# Altium schematic sheet ESC_C.SchDoc
size A3; SheetNumber: 9; SheetTotal: 10
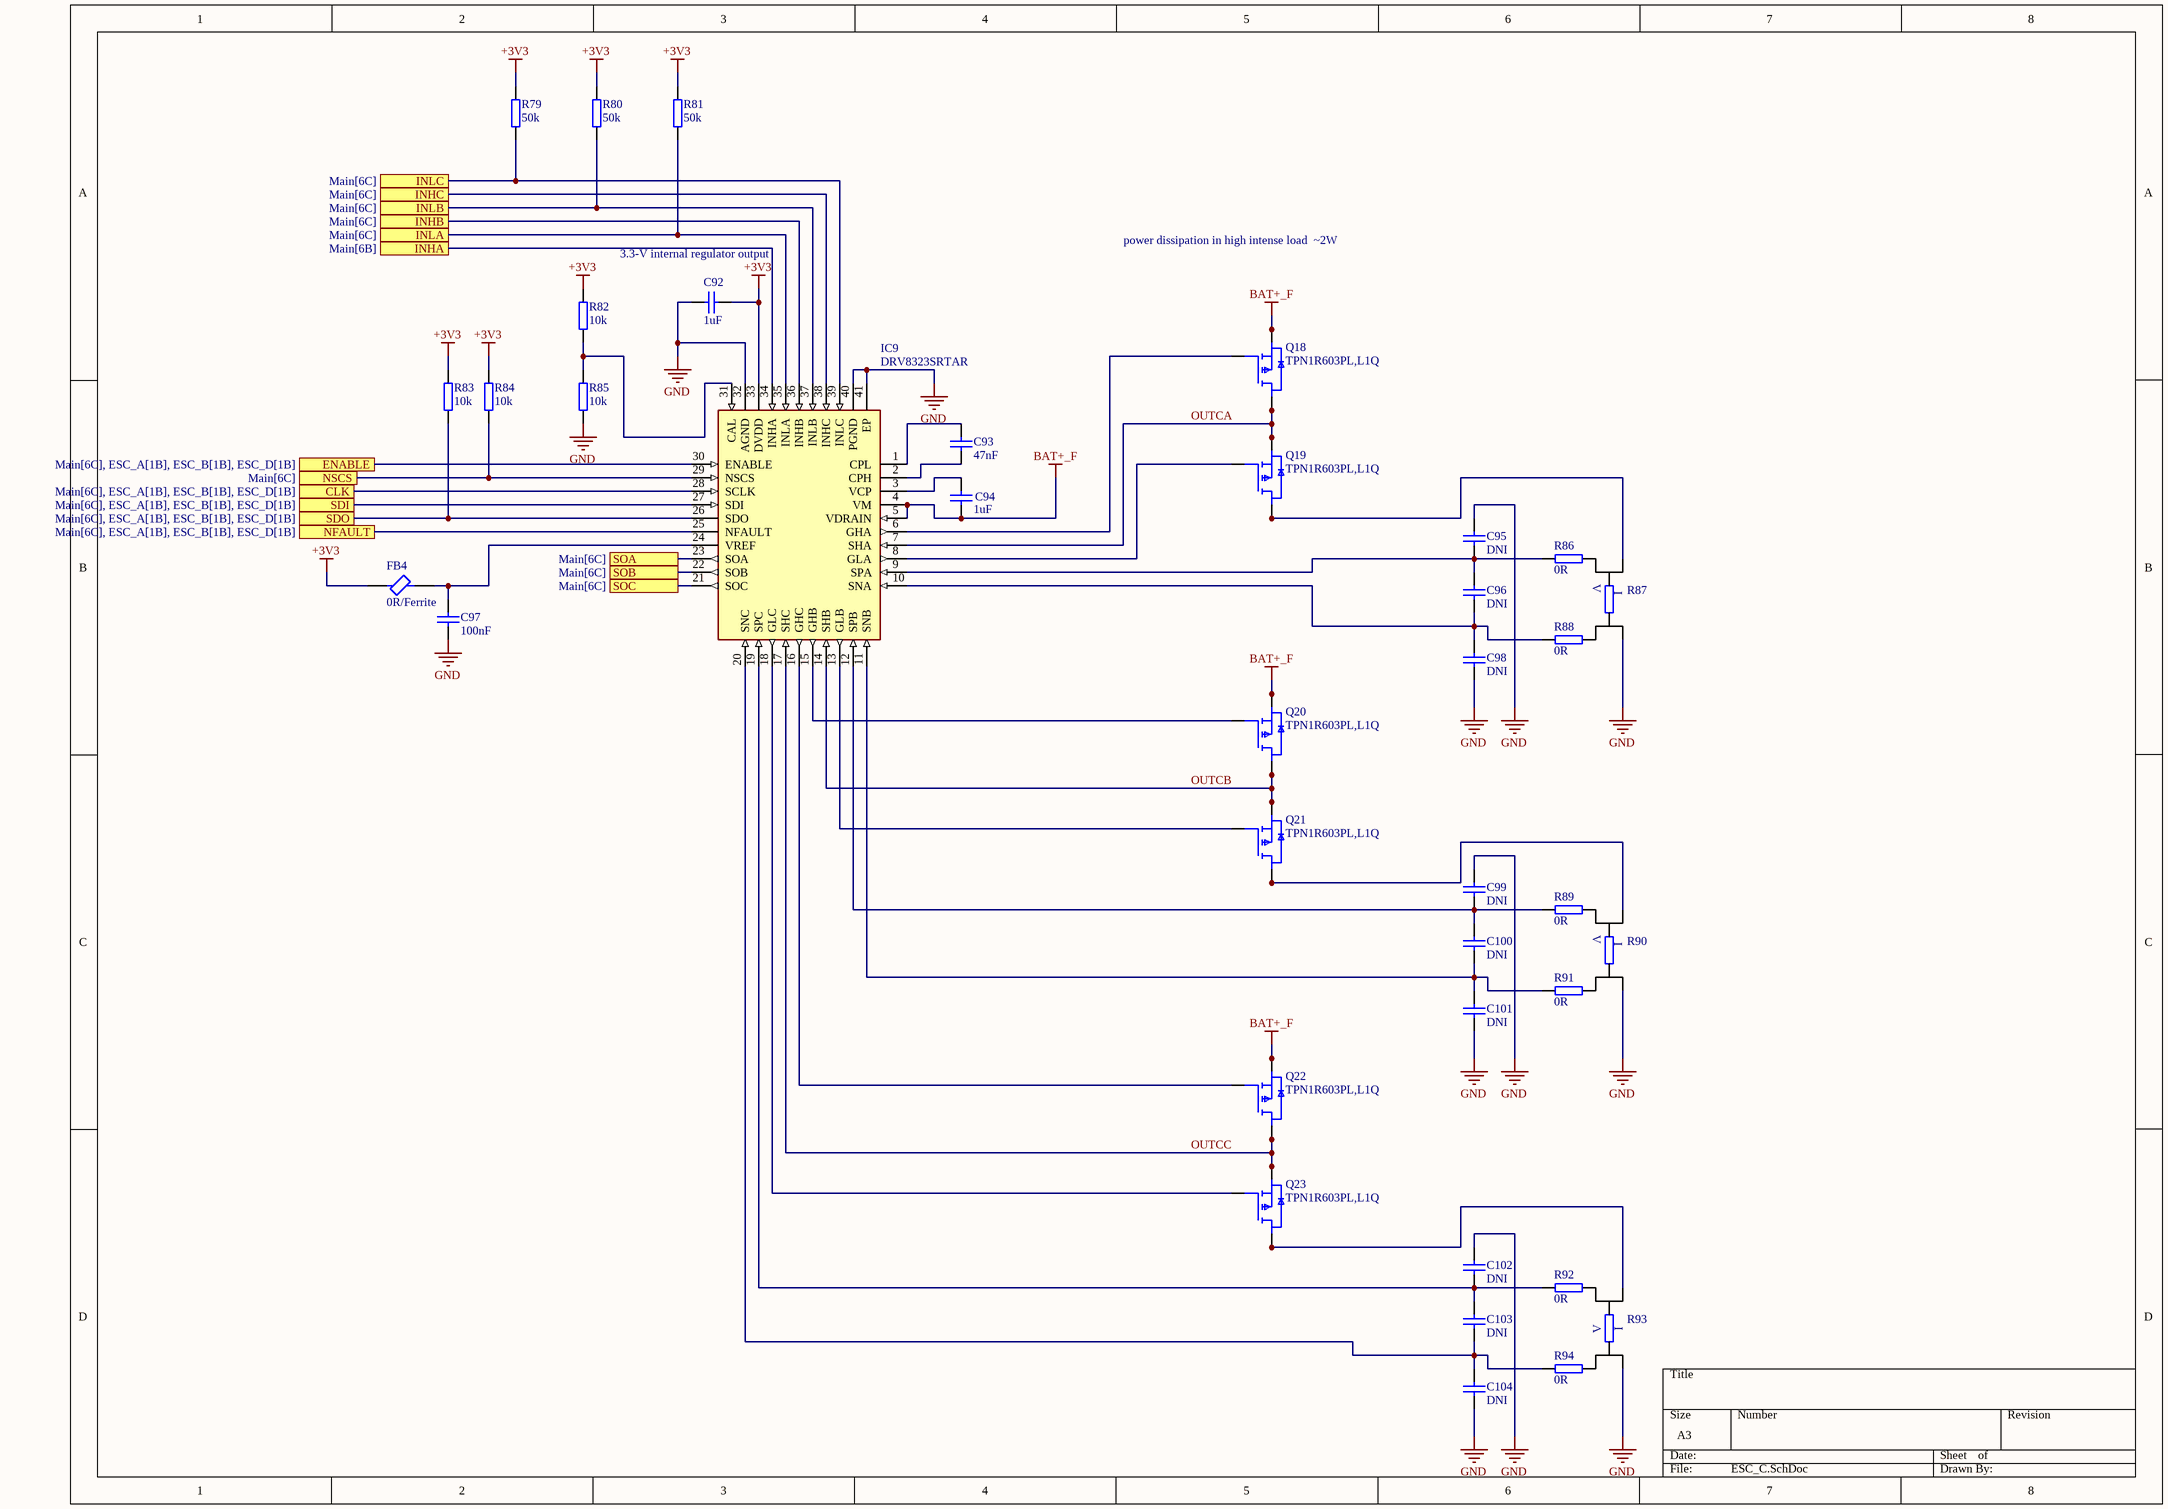
[diagram p0: ESC_C.SchDoc]

## Parts
C92  value 1uF  [CAP0402]  (hidden comment: Cap0402)
C93  value 47nF  [CAP0603]  (hidden comment: Cap0603)
C94  value 1uF  [CAP0603]  (hidden comment: Cap0603)
C95  value DNI  [CAP0402]  (hidden comment: Cap0402)
C96  value DNI  [CAP0402]  (hidden comment: Cap0402)
C97  value 100nF  [CAP0402]  (hidden comment: Cap0402)
C98  value DNI  [CAP0402]  (hidden comment: Cap0402)
C99  value DNI  [CAP0402]  (hidden comment: Cap0402)
C100  value DNI  [CAP0402]  (hidden comment: Cap0402)
C101  value DNI  [CAP0402]  (hidden comment: Cap0402)
C102  value DNI  [CAP0402]  (hidden comment: Cap0402)
C103  value DNI  [CAP0402]  (hidden comment: Cap0402)
C104  value DNI  [CAP0402]  (hidden comment: Cap0402)
FB4  0R/Ferrite  [NFZ15SG152SN10B]
IC9  DRV8323SRTAR  [QFN50P600X600X80-41N-D]
Q18  TPN1R603PL,L1Q  [TPN1R603PLL1Q]
Q19  TPN1R603PL,L1Q  [TPN1R603PLL1Q]
Q20  TPN1R603PL,L1Q  [TPN1R603PLL1Q]
Q21  TPN1R603PL,L1Q  [TPN1R603PLL1Q]
Q22  TPN1R603PL,L1Q  [TPN1R603PLL1Q]
Q23  TPN1R603PL,L1Q  [TPN1R603PLL1Q]
R79  value 50k  [RES0402]  (hidden comment: Res0402)
R80  value 50k  [RES0402]  (hidden comment: Res0402)
R81  value 50k  [RES0402]  (hidden comment: Res0402)
R82  value 10k  [RES0402]  (hidden comment: Res0402)
R83  value 10k  [RES0402]  (hidden comment: Res0402)
R84  value 10k  [RES0402]  (hidden comment: Res0402)
R85  value 10k  [RES0402]  (hidden comment: Res0402)
R86  value 0R  [RES0402]  (hidden comment: Res0402)
R87  WSK12161L000FEA  [WSK12161L000FEA]  (value not drawn)
R88  value 0R  [RES0402]  (hidden comment: Res0402)
R89  value 0R  [RES0402]  (hidden comment: Res0402)
R90  WSK12161L000FEA  [WSK12161L000FEA]  (value not drawn)
R91  value 0R  [RES0402]  (hidden comment: Res0402)
R92  value 0R  [RES0402]  (hidden comment: Res0402)
R93  WSK12161L000FEA  [WSK12161L000FEA]  (value not drawn)
R94  value 0R  [RES0402]  (hidden comment: Res0402)

## Ports
CLK (see Main[6C], ESC_A[1B], ESC_B[1B], ESC_D[1B]), ENABLE (see Main[6C], ESC_A[1B], ESC_B[1B], ESC_D[1B]), INHA (see Main[6B]), INHB (see Main[6C]), INHC (see Main[6C]), INLA (see Main[6C]), INLB (see Main[6C]), INLC (see Main[6C]), NFAULT (see Main[6C], ESC_A[1B], ESC_B[1B], ESC_D[1B]), NSCS (see Main[6C]), SDI (see Main[6C], ESC_A[1B], ESC_B[1B], ESC_D[1B]), SDO (see Main[6C], ESC_A[1B], ESC_B[1B], ESC_D[1B]), SOA (see Main[6C]), SOB (see Main[6C]), SOC (see Main[6C])

## Nets
+3V3: C92.2 FB4.1 IC9.33(DVDD) R79.2 R80.2 R81.2 R82.2 R83.2 R84.2
BAT+_F: C94.1 IC9.4(VM) IC9.5(VDRAIN) Q18.1(S_1) Q18.2(S_2) Q18.3(S_3) Q20.1(S_1) Q20.2(S_2) Q20.3(S_3) Q22.1(S_1) Q22.2(S_2) Q22.3(S_3)
GND: C92.1 C95.1 C97.1 C98.2 C99.1 C101.2 C102.1 C104.2 IC9.32(AGND) IC9.40(PGND) IC9.41(EP) R85.1 R87.4 R90.4 R93.1
CLK: IC9.28(SCLK) ; port CLK
ENABLE: IC9.30(ENABLE) ; port ENABLE
INHA: IC9.34(INHA) ; port INHA
INHB: IC9.36(INHB) ; port INHB
INHC: IC9.38(INHC) ; port INHC
INLA: IC9.35(INLA) R81.1 ; port INLA
INLB: IC9.37(INLB) R80.1 ; port INLB
INLC: IC9.39(INLC) R79.1 ; port INLC
NFAULT: IC9.25(NFAULT) ; port NFAULT
NSCS: IC9.29(NSCS) R84.1 ; port NSCS
OUTCA: IC9.7(SHA) Q18.5(D_1) Q18.6(D_2) Q18.7(D_3) Q18.8(D_4) Q18.9(D_4) Q19.1(S_1) Q19.2(S_2) Q19.3(S_3)
OUTCB: IC9.14(SHB) Q20.5(D_1) Q20.6(D_2) Q20.7(D_3) Q20.8(D_4) Q20.9(D_4) Q21.1(S_1) Q21.2(S_2) Q21.3(S_3)
OUTCC: IC9.17(SHC) Q22.5(D_1) Q22.6(D_2) Q22.7(D_3) Q22.8(D_4) Q22.9(D_4) Q23.1(S_1) Q23.2(S_2) Q23.3(S_3)
SDI: IC9.27(SDI) ; port SDI
SDO: IC9.26(SDO) R83.1 ; port SDO
SOA: IC9.23(SOA) ; port SOA
SOB: IC9.22(SOB) ; port SOB
SOC: IC9.21(SOC) ; port SOC
NetC93_1: C93.1 IC9.2(CPH)
NetC93_2: C93.2 IC9.1(CPL)
NetC94_2: C94.2 IC9.3(VCP)
NetC95_2: C95.2 C96.1 IC9.9(SPA) R86.1
NetC96_2: C96.2 C98.1 IC9.10(SNA) R88.1
NetC97_2: C97.2 FB4.2 IC9.24(VREF)
NetC99_2: C99.2 C100.1 IC9.12(SPB) R89.1
NetC100_2: C100.2 C101.1 IC9.11(SNB) R91.1
NetC102_2: C102.2 C103.1 IC9.19(SPC) R92.1
NetC103_2: C103.2 C104.1 IC9.20(SNC) R94.1
NetIC9_6: IC9.6(GHA) Q18.4(G)
NetIC9_8: IC9.8(GLA) Q19.4(G)
NetIC9_13: IC9.13(GLB) Q21.4(G)
NetIC9_15: IC9.15(GHB) Q20.4(G)
NetIC9_16: IC9.16(GHC) Q22.4(G)
NetIC9_18: IC9.18(GLC) Q23.4(G)
NetIC9_31: IC9.31(CAL) R82.1 R85.2
NetQ19_5: Q19.5(D_1) Q19.6(D_2) Q19.7(D_3) Q19.8(D_4) Q19.9(D_4) R87.1
NetQ21_5: Q21.5(D_1) Q21.6(D_2) Q21.7(D_3) Q21.8(D_4) Q21.9(D_4) R90.1
NetQ23_5: Q23.5(D_1) Q23.6(D_2) Q23.7(D_3) Q23.8(D_4) Q23.9(D_4) R93.4
NetR86_2: R86.2 R87.2
NetR87_3: R87.3 R88.2
NetR89_2: R89.2 R90.2
NetR90_3: R90.3 R91.2
NetR92_2: R92.2 R93.3
NetR93_2: R93.2 R94.2

## Notes on the sheet
- power dissipation in high intense load  ~2W
- 3.3-V internal regulator output
- (near IC9) Separate grounds?
- (in symbol WSK1216L5000FEA) V; I

## Library data of the parts
C92 = Cap0402: Manufacturer_Part_Number: GRM155R61H105KE05J; Voltage: 50V
C93 C94 = CapSMD0603: 50V; Published: 8-Jun-2000; LatestRevisionDate: 29-May-2009; LatestRevisionNote: IPC-7351 Footprint Added.; PackageReference: C1206; Publisher: Altium Limited; PackageDescription: Chip Capacitor
C97 = Cap0402: Manufacturer_Part_Number: GRM155R71H104ME14D; Voltage: 50V
FB4 = BLM15PE471SH1D: Ferrite Bead; Manufacturer_Name: Murata Electronics; Datasheet Link: https://www.murata.com/en-global/products/productdetail.aspx?cate=luNoiseSupprFilteChipFerriBead&partno=BLM15PE471SH1%23; Height: 0.55mm; Manufacturer_Part_Number: BLM15PE471SH1D; Mouser Part Number: 81-BLM15PE471SH1D; Mouser Price/Stock: https://www.mouser.co.uk/ProductDetail/Murata-Electronics/BLM15PE471SH1D?qs=DRkmTr78QATAY5qAVx1hGA%3D%3D
IC9 = DRV8323SRTAR: Integrated Circuit; Manufacturer_Name: Texas Instruments; Datasheet Link: http://www.ti.com/lit/ds/symlink/drv8323.pdf; Height: 0.8mm; Manufacturer_Part_Number: DRV8323SRTAR; Mouser Part Number: 595-DRV8323SRTAR; Mouser Price/Stock: https://www.mouser.co.uk/ProductDetail/Texas-Instruments/DRV8323SRTAR?qs=u4fy%2FsgLU9P2gpPTX6mffg%3D%3D; Arrow Part Number: DRV8323SRTAR; Arrow Price/Stock: https://www.arrow.com/en/products/drv8323srtar/texas-instruments?utm_currency=USD&region=nac
Q18-Q23 = TPN1R603PL,L1Q: MOSFET (N-Channel); Manufacturer_Name: Toshiba; Datasheet Link: https://toshiba.semicon-storage.com/ap-en/semiconductor/product/mosfets/12v-300v-mosfets/detail.TPN1R603PL.html; Height: 0.9mm; Manufacturer_Part_Number: TPN1R603PL,L1Q; Mouser Part Number: 757-TPN1R603PLL1Q; Mouser Price/Stock: https://www.mouser.co.uk/ProductDetail/Toshiba/TPN1R603PLL1Q?qs=bUPhaerQQeGYpGlYi%252BLguw%3D%3D; Arrow Part Number: TPN1R603PL,L1Q; Arrow Price/Stock: https://www.arrow.com/en/products/tpn1r603pll1q/toshiba?utm_currency=USD&region=nac
R79-R81 = Res0402: Manufacturer_Part_Number: TNPW040249K9DEED
R82-R85 = Res0402: Manufacturer_Part_Number: ERA-2AED103X
R86 R88 R89 R91 R92 R94 = Res0402: Manufacturer_Part_Number: RCA04020000ZSED
R87 R90 R93 = WSK1216L5000FEA: Resistor; Manufacturer_Name: Vishay; Datasheet Link: http://www.vishay.com/docs/30189/wsk1216.pdf; Height: 1.9mm; Manufacturer_Part_Number: WSK1216L5000FEA; Mouser Part Number: 71-WSK1216L5000FEA; Mouser Price/Stock: https://www.mouser.co.uk/ProductDetail/Vishay-Dale/WSK1216L5000FEA?qs=OlC7AqGiEDlM2wGD42LFoQ%3D%3D; Arrow Part Number: WSK1216L5000FEA; Arrow Price/Stock: https://www.arrow.com/en/products/wsk1216l5000fea/vishay?region=nac
C95 C96 C98-C104 = Cap0402: Voltage: DNI